# EAGLE design NSE2022_BATTERY_ver0 (EAGLE 9.6.0)
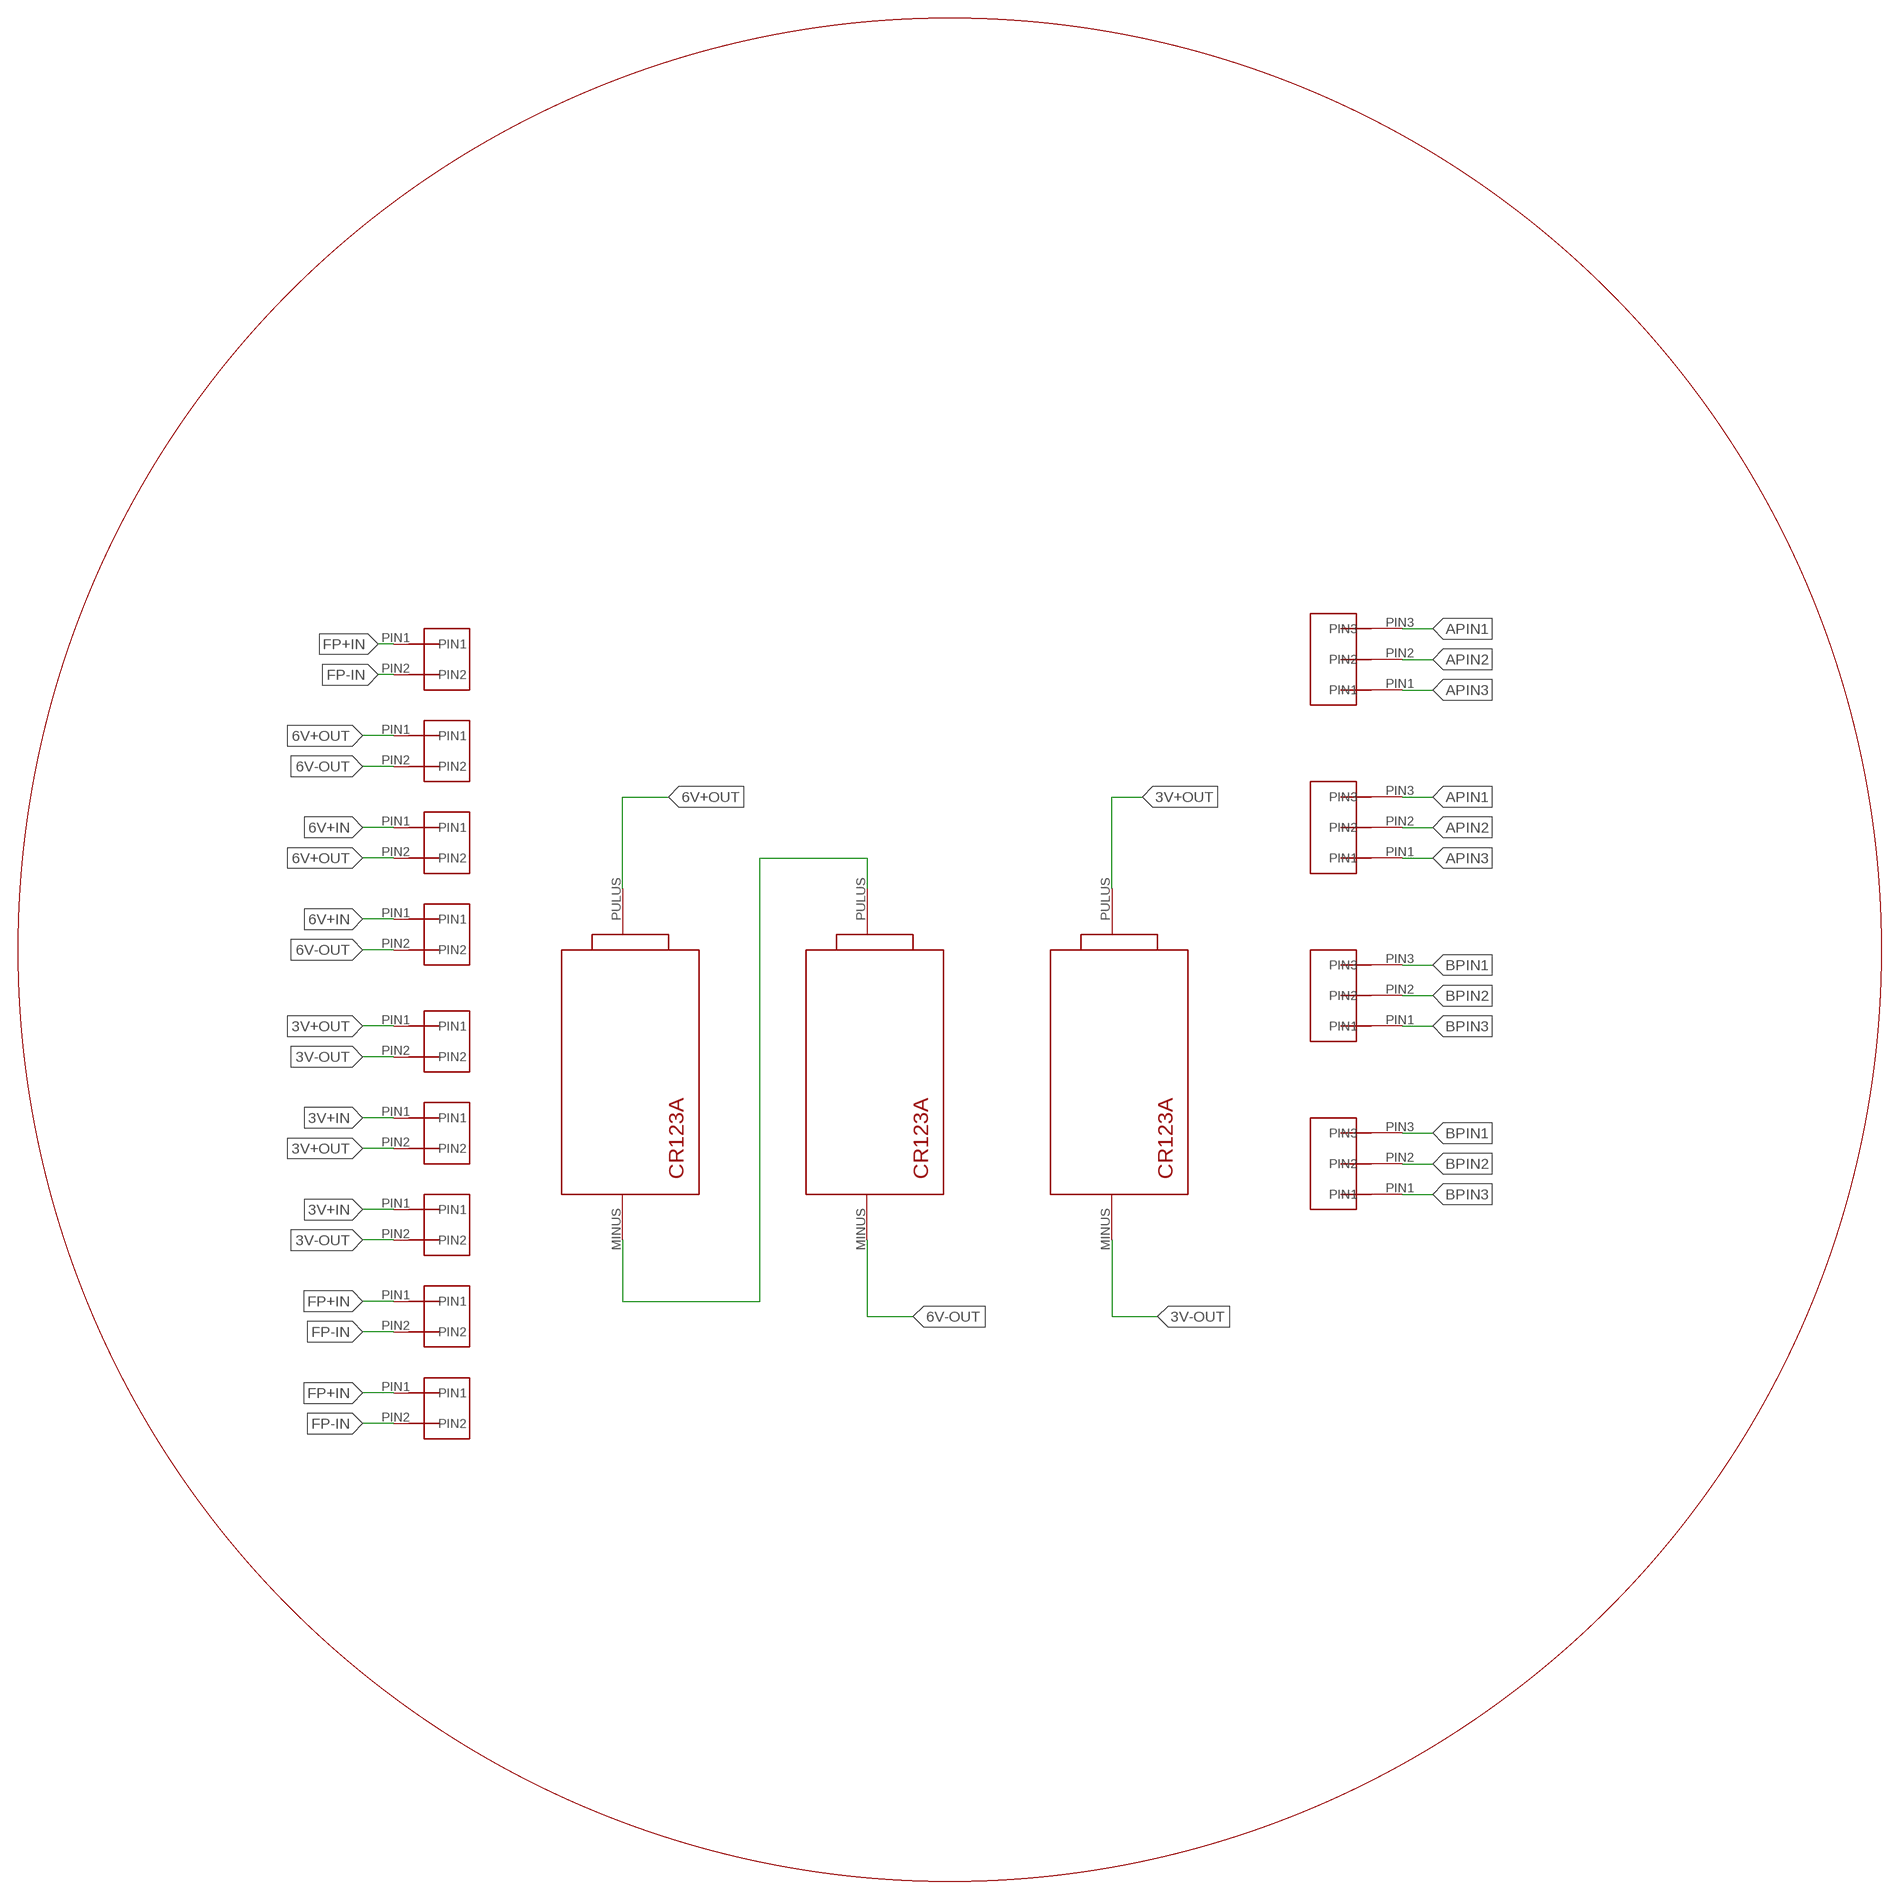
[diagram p0: schematic, sheet 1]

## Parts
U$25  CR123A  [CR123A]
U$34  CR123A  [CR123A]
U$38  CR123A  [CR123A]
U$41  2PIN  [2PIN]
U$45  2PIN  [2PIN]
U$56  2PIN  [2PIN]
U$57  2PIN  [2PIN]
U$58  2PIN  [2PIN]
U$59  3PIN  [3PIN]
U$60  3PIN  [3PIN]
U$61  3PIN  [3PIN]
U$62  3PIN  [3PIN]
U$65  2PIN  [2PIN]
U$66  2PIN  [2PIN]
U$67  2PIN  [2PIN]
U$68  2PIN  [2PIN]

## Nets
3V+IN: U$56.PIN1 U$65.PIN1
3V+OUT: U$38.PULUS(PULAS) U$45.PIN1 U$56.PIN2
3V-OUT: U$38.MINUS U$45.PIN2 U$65.PIN2
6V+IN: U$67.PIN1 U$68.PIN1
6V+OUT: U$25.PULUS(PULAS) U$41.PIN1 U$67.PIN2
6V-OUT: U$34.MINUS U$41.PIN2 U$68.PIN2
APIN1: U$59.PIN3 U$60.PIN3
APIN2: U$59.PIN2 U$60.PIN2
APIN3: U$59.PIN1 U$60.PIN1
BPIN1: U$61.PIN3 U$62.PIN3
BPIN2: U$61.PIN2 U$62.PIN2
BPIN3: U$61.PIN1 U$62.PIN1
FP+IN: U$57.PIN1 U$58.PIN1 U$66.PIN1
FP-IN: U$57.PIN2 U$58.PIN2 U$66.PIN2
N$13: U$25.MINUS U$34.PULUS(PULAS)

## Library data of the parts
U$25 U$34 U$38 = CR123A:CR123A
U$41 U$45 U$56-U$58 U$65-U$68 = 2PIN:2PIN
U$59-U$62 = 3PIN:3PIN

## Board
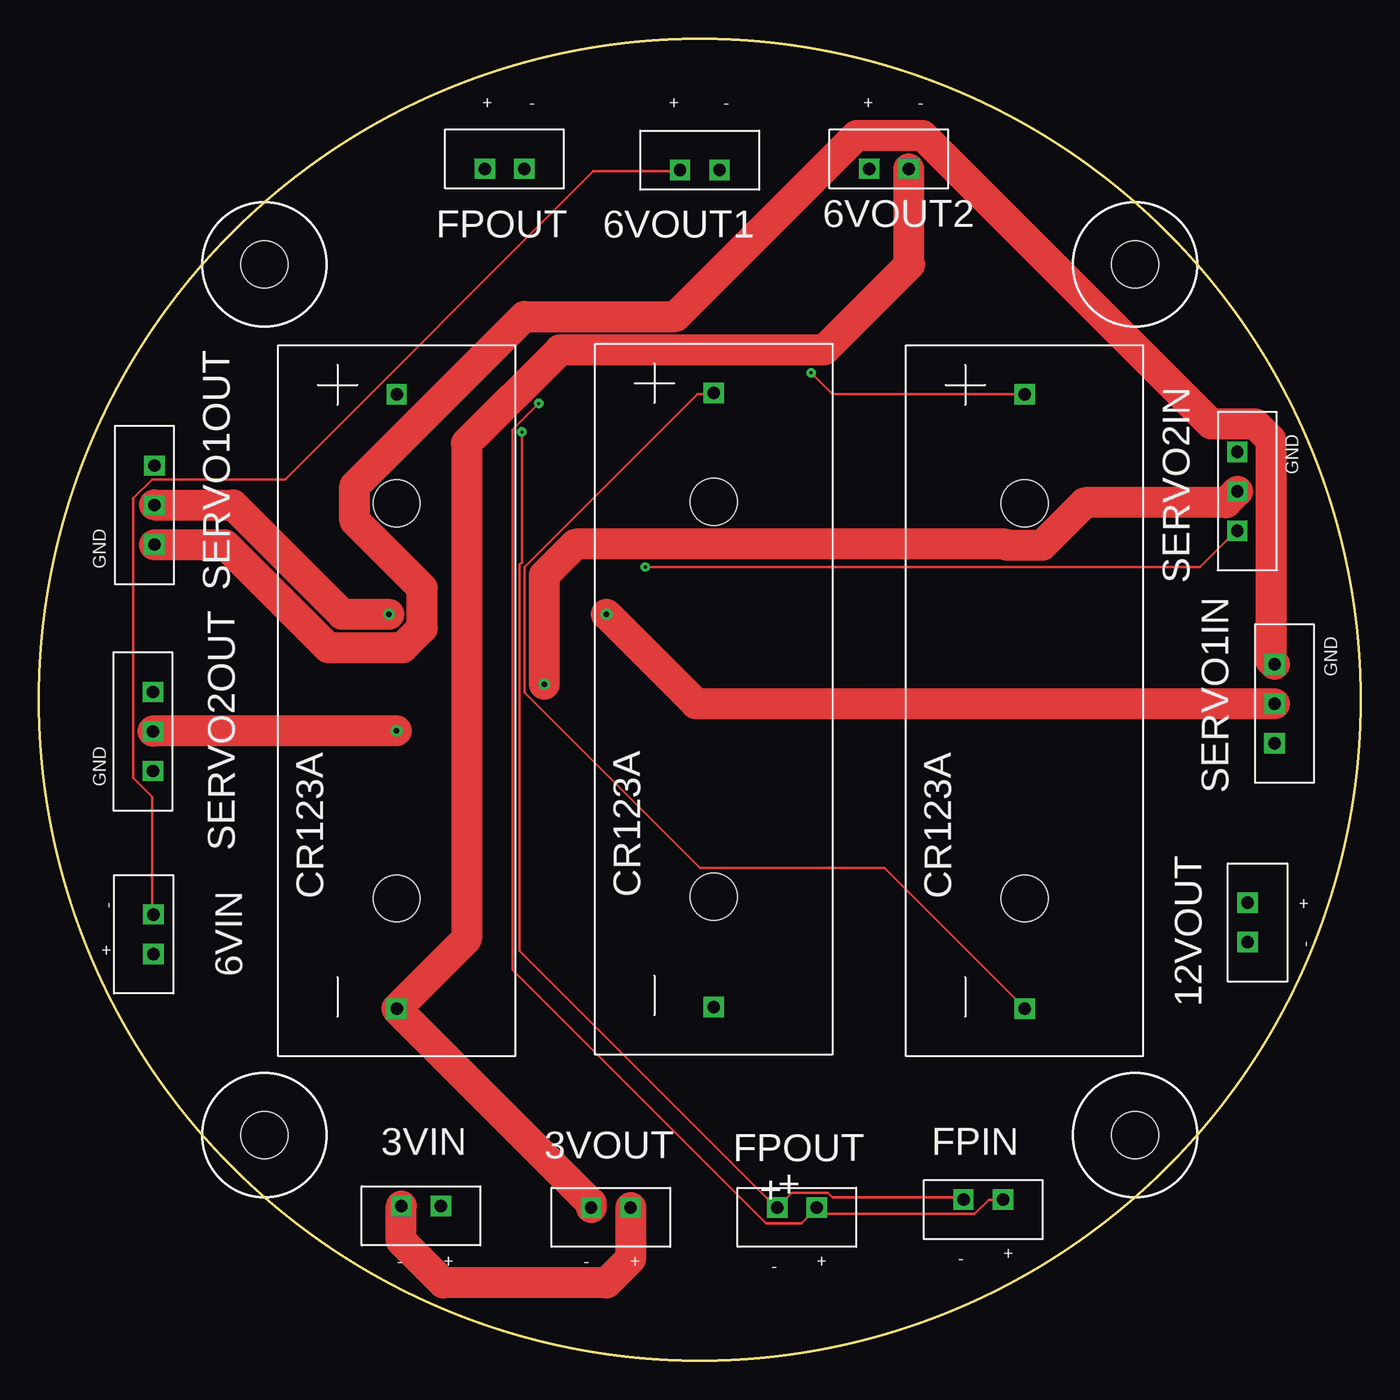
[diagram p1: board, top side]
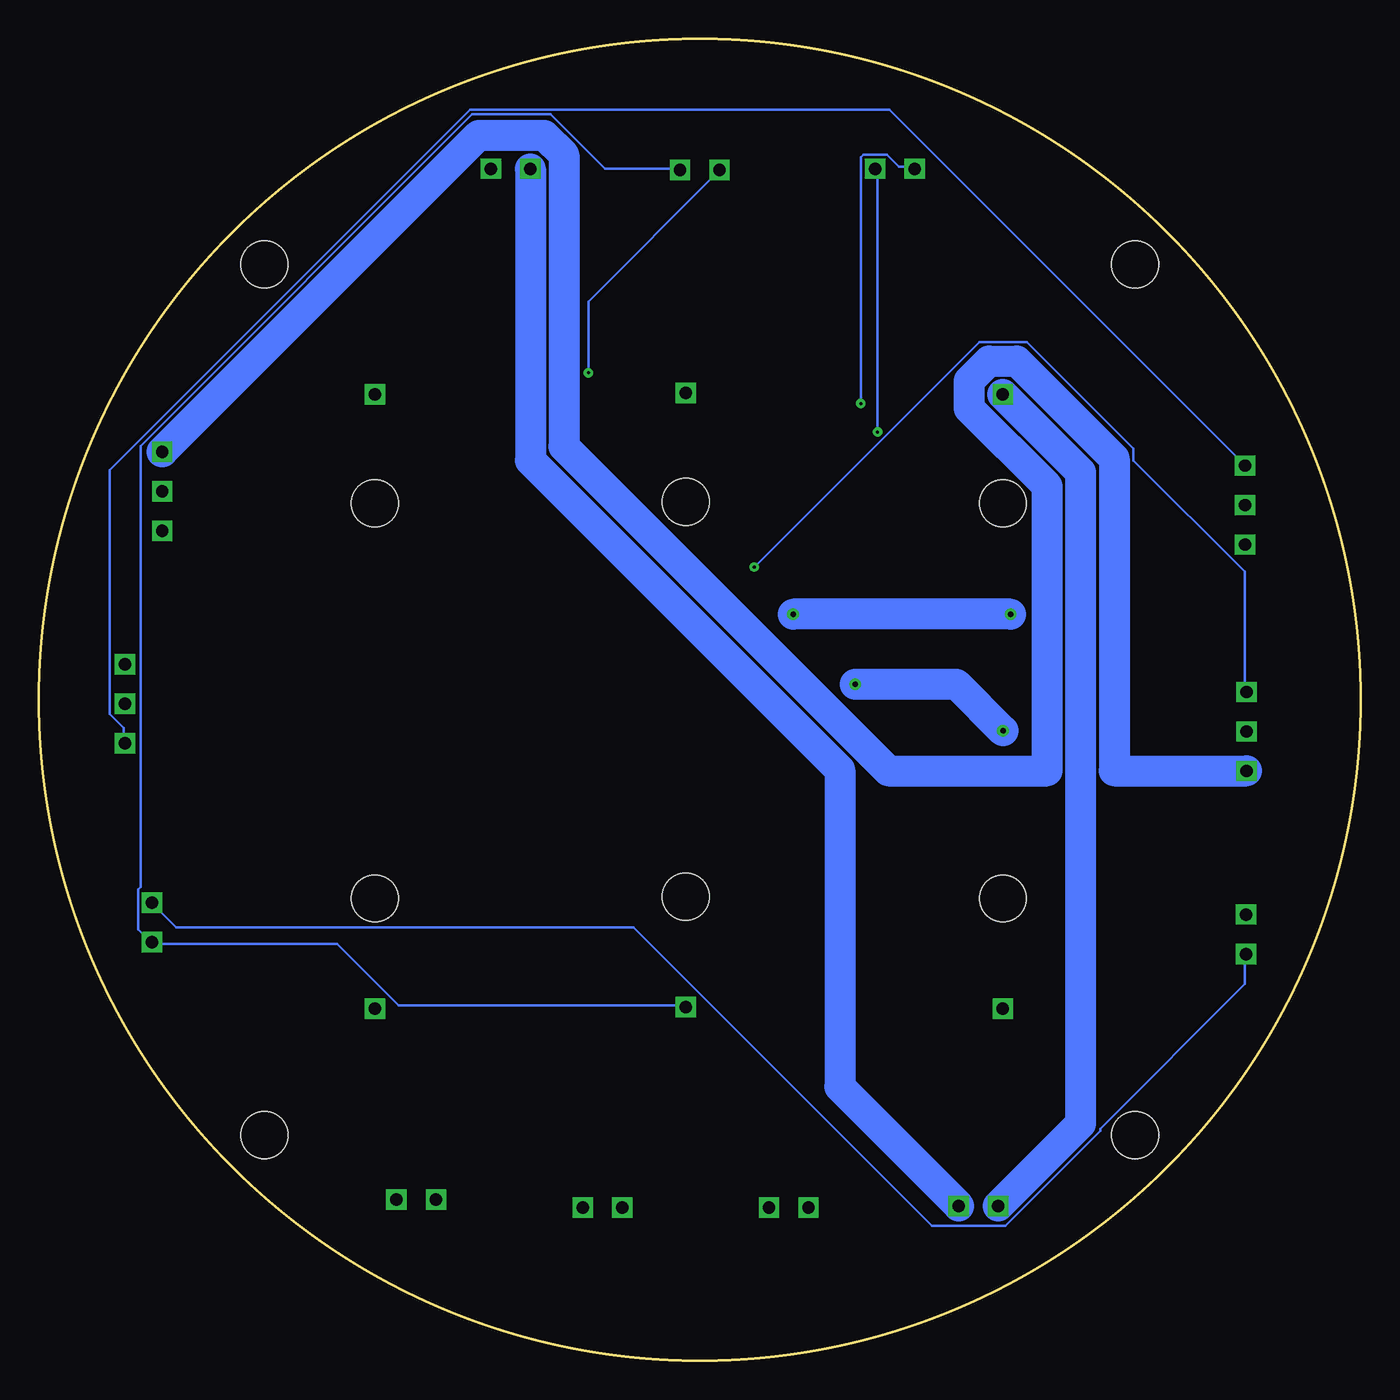
[diagram p2: board, bottom side, seen from below]

Size 85 x 85 mm. Coordinates in mm from the lower left corner, seen from the top.
Outline: circle at 42.5,42.5 radius 42.5
Copper layers (1*16): Top 0.035mm / dielectric 1.5mm / Bottom 0.035mm
Design rules "PCBGoGo": minimum track width 6mil, minimum drill 0.2mm, track to track 6mil, track to pad 6mil, pad to pad 6mil, via to via 6mil, smd to smd 6mil, copper to edge 0.2mm, drill to drill 6mil, minimum pad ring 10mil, minimum via ring 8mil, stop-mask expansion 4mil, vias tented up to drill 0mil, thermal gap 10mil
Holes 3 mm at 70.5,70.5 14.5,70.5 70.5,14.5 14.5,14.5

### Footprints (pad centres in the part's own frame; a part is rotated, then mirrored left to right if it is on the bottom)
CR123A = drill 0.8 square: MINUS 32.5,0; PULUS -7,0 | hole 3: 0,0; 25.4,0
2PIN = drill 0.8 square: PIN1 1.27,0; PIN2 3.81,0
3PIN = drill 0.8 square: PIN1 1.27,0; PIN2 3.81,0; PIN3 6.35,0

### Placement (x,y rotation side)
U$25  63.39,55.13 270 top
U$34  43.4,55.23 270 top
U$38  23.01,55.13 270 top
U$41  39.96,76.57 0 top
U$45  39.32,9.85 180 top
U$56  27.11,9.95 180 top
U$57  27.4,76.65 0 top
U$58  51.29,9.85 180 top
U$59  79.47,46.06 270 top
U$60  7.43,51.21 90 top
U$61  77.07,59.72 270 top
U$62  7.33,36.65 90 top
U$65  52.12,76.65 0 top
U$66  63.27,10.35 180 top
U$67  7.37,24.88 90 top
U$68  77.73,30.71 270 top

### Tracks (layer width: path | path; a pad name or v marks a point on that pad's centre or on a via)
3V+IN
  Bottom 2: U$65.PIN1 53.39,57.89 33.5,38 33.5,17.61 U$56.PIN1
3V+OUT
  Top 2: U$45.PIN1 38.05,6.55 36.5,5 26,5 23.3,7.7 U$56.PIN2
  Bottom 2: U$56.PIN2 18,15.25 18,57.12 U$38.PULUS
3V-OUT
  Top 2: U$65.PIN2 55.93,70.57 56,70.5 50.5,65 33.5,65 27.5,59 27.5,27.12 U$38.MINUS 35.51,10.13 U$45.PIN2
6V+IN
  Bottom 0.152: U$67.PIN1 7.45,26.04 7.45,24.21 16.74,14.92 16.74,14.76 22.84,8.67 27.56,8.67 46.77,27.87 76.18,27.87 77.7,29.39 U$68.PIN1
6V+OUT  (via drill 0.2)
  Top 0.152: U$67.PIN2 7.3,28.78 7.3,36.25 6.08,37.47 6.08,55.45 7.3,56.67 15.83,56.67 35.64,76.48 41.13,76.48 U$41.PIN1 | v49.66,63.53 51.03,62.16 63.38,62.16 U$25.PULUS
  Bottom 0.152: v49.66,63.53 49.66,68.1 41.28,76.48 U$41.PIN1
6V-OUT
  Bottom 0.152: U$34.MINUS 43.41,22.84 61.86,22.84 65.82,26.8 77.7,26.8 U$68.PIN2 77.86,26.95 78.62,27.72 78.62,30.31 78.47,30.46 78.47,58.81 57.13,80.14 52.1,80.14 48.6,76.64 43.87,76.64 U$41.PIN2
APIN1
  Bottom 0.152: U$59.PIN3 79.53,39.76 79.53,40.67 80.45,41.59 80.45,57.28 57.28,80.45 30.31,80.45 7.45,57.59 U$60.PIN3
APIN2  (via drill 0.35)
  Top 2: U$60.PIN2 12.48,55.02 19.5,48 v22.5,48 | v36.5,48 42.25,42.25 U$59.PIN2
  Bottom 2: v22.5,48 v36.5,48
APIN3
  Top 2: U$60.PIN1 11.98,52.48 18.61,45.85 23.39,45.85 24.65,47.11 24.65,49.67 20.31,54.01 20.31,56.25 31.21,67.15 40.95,67.15 52.61,78.8 56.82,78.8 75.37,60.26 78.2,60.26 79.22,59.23 79.22,45.04 U$59.PIN1
BPIN1  (via drill 0.2)
  Top 0.152: v38.99,51.03 74.66,51.03 76.94,53.32 U$61.PIN3
  Bottom 0.152: v38.99,51.03 24.52,65.51 21.47,65.51 14.61,58.65 14.61,57.89 7.45,50.73 7.45,43.11 U$62.PIN3
BPIN2  (via drill 0.35)
  Top 2: U$61.PIN2 76.34,55.18 67.25,55.18 64.51,52.43 62.27,52.43 62.2,52.5 34.5,52.5 32.5,50.5 v32.5,43.5 | v23,40.5 7.37,40.5 U$62.PIN2
  Bottom 2: v32.5,43.5 26,43.5 v23,40.5
BPIN3
  Bottom 2: U$62.PIN1 15.85,37.92 15.85,58.01 22.12,64.28 23.9,64.28 25.16,63.02 25.16,61.24 20.15,56.23 20.15,37.92 30.38,37.92 51.24,58.78 51.24,77.54 52.5,78.8 56.72,78.8 U$61.PIN1
FP+IN  (via drill 0.2)
  Top 0.152: v32.14,61.55 30.46,59.87 30.46,25.13 46.77,8.82 49.05,8.82 49.97,9.73 U$58.PIN1 50.12,9.73 50.42,9.43 60.18,9.43 61.09,10.34 61.86,10.34 U$66.PIN1
  Bottom 0.152: v32.14,61.55 32.14,77.4 31.98,77.55 30.46,77.55 29.7,76.79 28.78,76.79 U$57.PIN1
FP-IN  (via drill 0.2)
  Top 0.152: v31.07,59.72 31.07,51.34 30.92,51.19 30.92,26.35 47.38,9.89 U$58.PIN2 47.53,9.89 48.44,10.8 50.73,10.8 51.03,10.5 59.42,10.5 U$66.PIN2
  Bottom 0.152: v31.07,59.72 31.07,76.64 U$57.PIN2
N$13
  Top 0.152: U$34.PULUS 43.26,62.16 42.35,62.16 31.22,51.03 31.22,42.96 42.5,31.68 54.39,31.68 63.38,22.69 U$25.MINUS

### Text on the board
tPlace: + | - | + | - | + | - | GND | GND | GND | GND | - | + | + | - | - | + | - | + | - | + | - | +
tNames: FPOUT | 6VOUT1 | 6VOUT2 | SERVO1OUT | SERVO2IN | SERVO1IN | SERVO2OUT | 12VOUT | 6VIN | 3VIN | FPOUT | FPIN | 3VOUT | + | +